# EAGLE design Trackball-9500 (EAGLE 5.11)
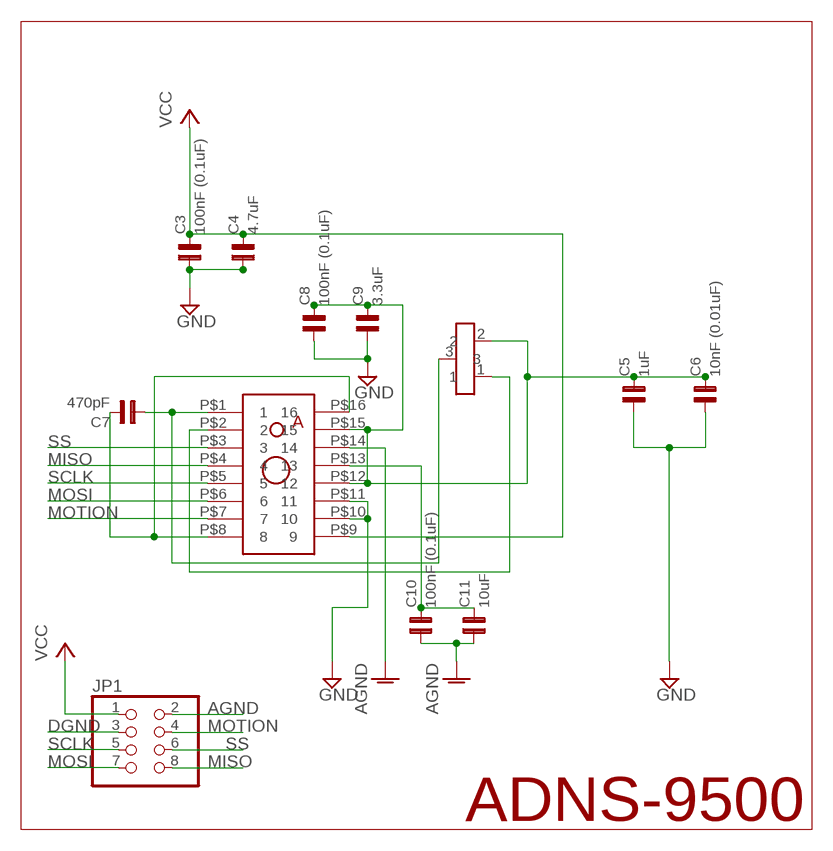
[diagram p0: schematic, sheet 1]

## Parts
C3  100nF (0.1uF)  C0603  [0603]
C4  4.7uF  C0805  [0805]
C5  1uF  C0805  [0805]
C6  10nF (0.01uF)  C0603  [0603]
C7  470pF  C0603  [0603]
C8  100nF (0.1uF)  C0603  [0603]
C9  3.3uF  C0805  [0805]
C10  100nF (0.1uF)  C0603  [0603]
C11  10uF  C0805  [0805]
JP1  PINHD-2X4  [2X04]
Q1  TRANSISTOR_SC-75  [SC-75_TRANSISTOR]
U$1  AVAGO_ADNS-9500  [AVAGO_ADNS-9500]

## Nets
AGND: C3.1 C4.1 C5.1 C6.1 C8.1 C9.1 C10.1 C11.1 JP1.2 U$1.P$10 U$1.P$11 ; supply symbol labelled GND
DGND: JP1.3 U$1.P$14 ; supply symbol labelled AGND
MISO: JP1.8 U$1.P$4
MOSI: JP1.7 U$1.P$6
MOTION: JP1.4 U$1.P$7
N$1: Q1.1 U$1.P$2
N$2: C7.1 Q1.3 U$1.P$1
N$3: C5.2 C6.2 C8.2 C9.2 Q1.2 U$1.P$12 U$1.P$15
N$4: C7.2 U$1.P$8 U$1.P$16
N$7: C10.2 C11.2 U$1.P$13
SCLK: JP1.5 U$1.P$5
SS: JP1.6 U$1.P$3
VCC: C3.2 C4.2 JP1.1 U$1.P$9

## Notes on the sheet
- ADNS-9500

## Library data of the parts
C3 C6-C8 C10 = capsmd:C0603
C4 C5 C9 C11 = capsmd:C0805
JP1 = pinhead:PINHD-2X4: PIN HEADER
Q1 = JKCustom:TRANSISTOR_SC-75: SC-75 Package
U$1 = JKCustom:AVAGO_ADNS-9500

## Net classes
0 default: width 0.254 mm

## Board
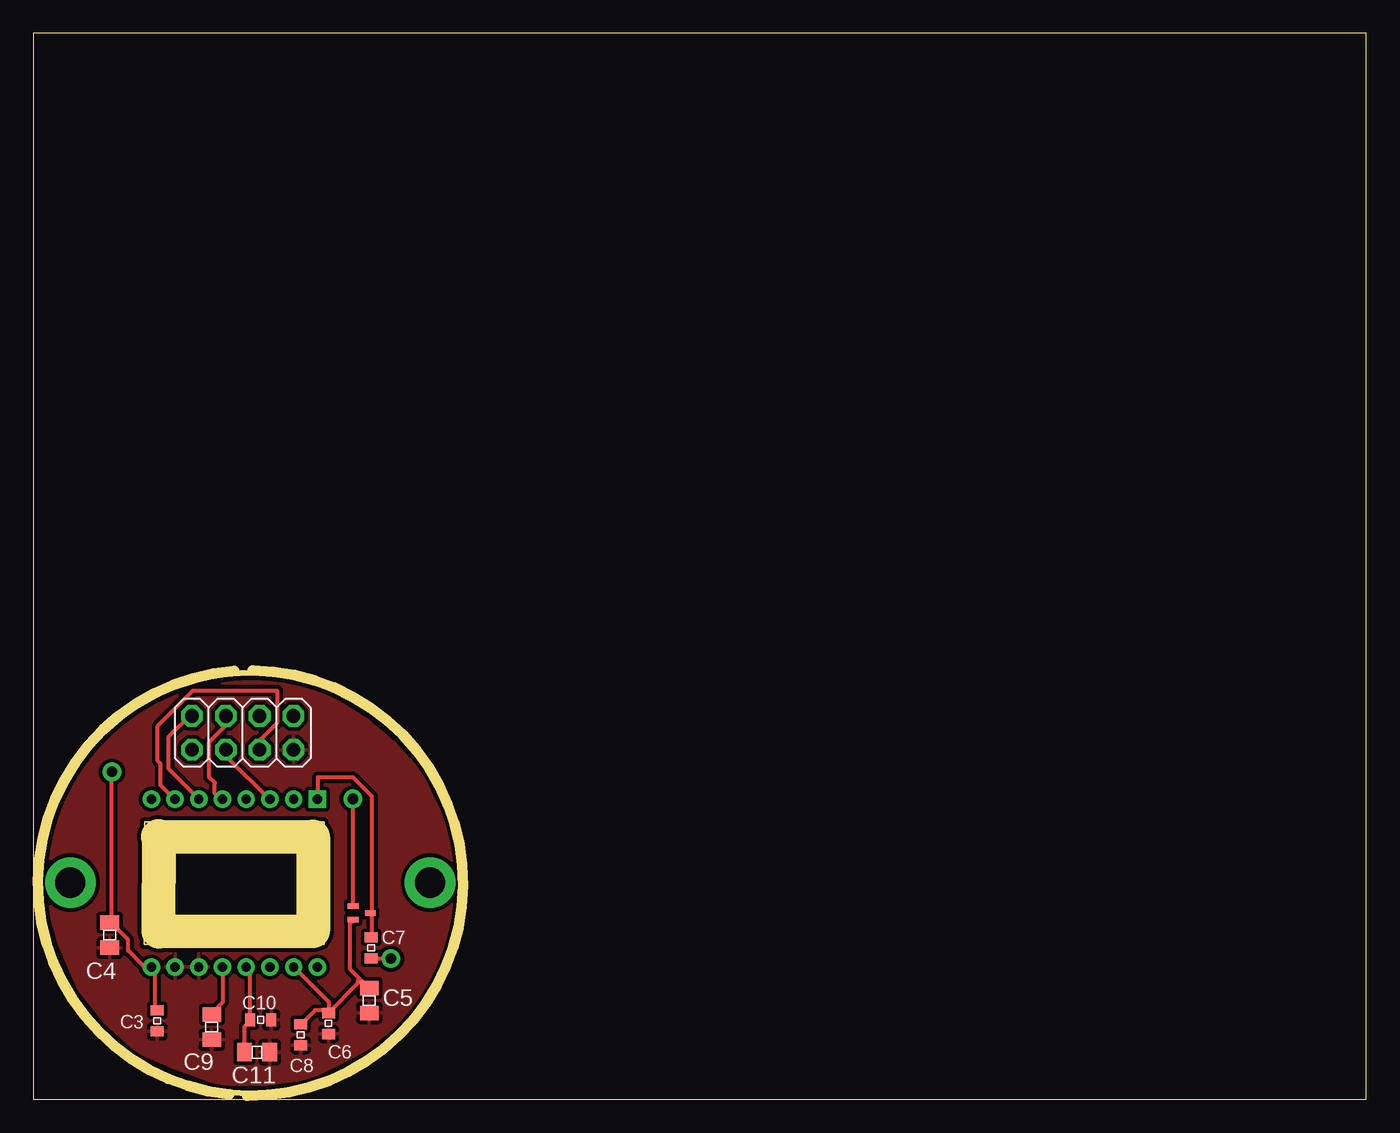
[diagram p1: board, top side]
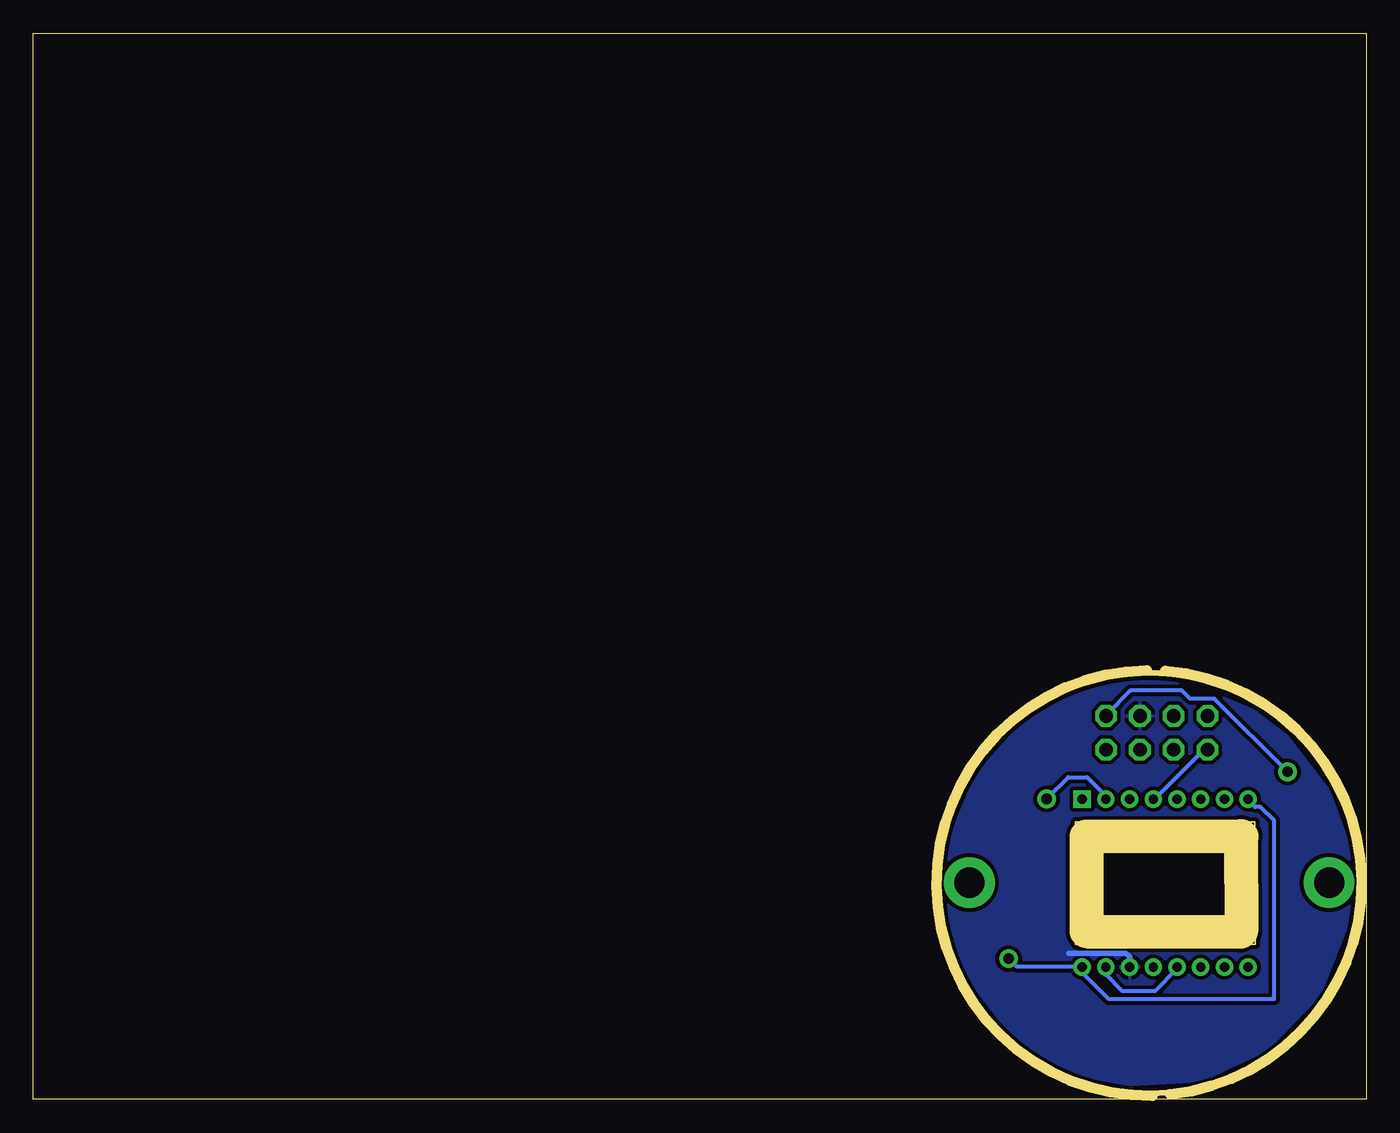
[diagram p2: board, bottom side, seen from below]

Size 100 x 80 mm. Coordinates in mm from the lower left corner, seen from the top.
Outline: 9.4,19.76 9.38,12.62
Outline: 9.35,19.74 20.98,19.71 20.98,12.62 9.43,12.6
Outline: 0,0 100,0 100,80 0,80 0,0
Outline: circle at 16.29,16.23 radius 15.76
Copper layers (1*16): Top 0.035mm / dielectric 1.5mm / Bottom 0.035mm
Design rules "default *": minimum track width 12mil, minimum drill 0.7938mm, track to track 10mil, track to pad 10mil, pad to pad 10mil, via to via 10mil, smd to smd 10mil, copper to edge 10mil, drill to drill 6mil, minimum pad ring 12mil, minimum via ring 12mil, stop-mask expansion 12mil, vias tented up to drill 0mil, thermal gap 12mil
Milling: 2 lines

### Footprints (pad centres in the part's own frame; a part is rotated, then mirrored left to right if it is on the bottom)
0603 = smd 0.762 x 0.965: 1 -0.787,0; 2 0.787,0
0805 = smd 1.092 x 1.397: 1 -0.94,0; 2 0.94,0
2X04 = drill 1.016 octagon: 1 -3.81,-1.27; 2 -3.81,1.27; 3 -1.27,-1.27; 4 -1.27,1.27; 5 1.27,-1.27; 6 1.27,1.27; 7 3.81,-1.27; 8 3.81,1.27
SC-75_TRANSISTOR = smd 0.406 x 0.813: 1 0.2,0.4; 2 1.2,0.4; 3 0.7,1.7
AVAGO_ADNS-9500 = drill 0.7 pad 1.3 square: P$1 0,0 | drill 0.7 pad 1.3 round: P$2 -1.78,0; P$3 -3.56,0; P$4 -5.34,0; P$5 -7.12,0; P$6 -8.9,0; P$7 -10.68,0; P$8 -12.46,0; P$9 -12.46,-12.6; P$10 -10.68,-12.6; P$11 -8.9,-12.6; P$12 -7.12,-12.6; P$13 -5.34,-12.6; P$14 -3.56,-12.6; P$15 -1.78,-12.6; P$16 0,-12.6

### Placement (x,y rotation side)
C3  9.3,5.89 90 top
C4  5.73,12.33 90 top
C5  25.2,7.43 90 top
C6  22.15,5.7 90 top
C7  25.35,11.39 270 top
C8  20.06,4.87 90 top
C9  13.39,5.42 90 top
C10  17.06,5.97 180 top
C11  16.79,3.55 180 top
JP1  15.71,27.51 180 top
Q1  23.59,14.7 270 top
U$1  21.31,22.54 0 top

### Tracks (layer width: path | path; a pad name or v marks a point on that pad's centre or on a via)
AGND
  pour Top (isolate 0.279): 15.88,31.6 arc6 13.79,31.34 11.79,30.94 10.39,30.25 8.36,29.29 6.78,28.19 4.68,26.09 3,23.78 2.06,21.82 1.35,19.63 1.09,17.83 1.09,14.63 1.98,11.61 3.46,8.23 5.39,5.79 7.88,3.53 10.62,2.36 14.02,1.14 17.4,1.14 20.6,1.55 22.43,2.44 25.05,3.81 26.88,5.36 28.86,7.49 30.05,9.45 31.02,12.12 31.55,14.96 31.37,18.82 30.48,21.57 28.98,24.66 27.08,26.77 25.12,28.4 22.84,29.85 20.4,31.01 18.11,31.4 16.36,31.6
DGND
  Bottom 0.406: U$1.P$14 17.75,10.69 18.04,10.97 22.3,10.97
  pour Bottom (isolate 0.279): 15.24,31.55 arc20 12.37,30.86 8.44,29.16 5.97,27.28 2.85,23.24 1.25,18.85 0.97,16.13 1.55,12.78 3.53,7.82 7.47,3.73 12.45,1.42 17.66,1.12 22,1.91 26.65,4.93 30.1,9.4 31.52,14.17 31.37,19.13 29.29,24.28 26.06,27.94 21.74,30.51 18.44,31.4
MISO
  Bottom 0.305: U$1.P$4 15.85,22.56 12.19,26.21 11.99,26.21 JP1.8
MOSI
  Top 0.305: U$1.P$6 12.4,22.56 10.16,24.79 10.16,27.23 11.79,28.85 JP1.7
MOTION
  Top 0.305: U$1.P$7 10.57,22.56 9.55,23.57 9.55,25.2 9.35,25.4 9.35,28.04 11.99,30.68 18.29,30.68 18.29,28.25 17.07,27.03 17.07,26.42 JP1.4
N$1  (via drill 0.79)
  Top 0.305: v23.98,22.56 23.98,14.63 Q1.1
  Bottom 0.305: v23.98,22.56 22.35,24.18 20.93,24.18 19.71,22.96 19.71,22.56 U$1.P$2
N$2
  Top 0.305: C7.1 25.4,12.19 25.4,13.82 Q1.3 25.4,14.02 25.4,22.76 23.98,24.18 21.34,24.18 21.34,22.56 U$1.P$1
N$3
  Top 0.305: C9.2 13.41,6.5 14.23,7.32 14.23,9.75 U$1.P$12 | C8.2 20.12,5.69 21.14,6.71 21.95,6.71 21.95,6.5 C6.2 | 24.49,9.04 25.2,8.33 C5.2 | 24.49,9.04 23.78,9.75 23.78,13.21 23.98,13.41 Q1.2 | C6.2 22.15,6.5 24.39,8.74 24.39,8.94 24.49,9.04 | U$1.P$15 19.71,9.75 22.15,7.32 22.15,6.71 C6.2
  Bottom 0.305: U$1.P$12 14.23,9.75 15.85,8.13 18.29,8.13 19.51,9.35 19.51,9.75 U$1.P$15
N$4  (via drill 0.79)
  Top 0.305: v26.82,10.57 25.4,10.57 C7.2
  Bottom 0.305: v26.82,10.57 26.22,9.96 21.74,9.96 | 21.74,9.96 21.34,9.96 U$1.P$16 21.74,9.96 | 21.74,9.96 19.31,7.52 6.91,7.52 6.91,20.93 7.93,21.95 8.33,21.95 8.74,22.35 U$1.P$8
N$5  (via drill 2.26 pad 3.81)
  other vias: 29.77,16.27
N$6  (via drill 2.26 pad 3.81)
  other vias: 2.78,16.27
N$7
  Top 0.305: C11.2 15.85,3.66 15.85,5.49 16.26,5.89 C10.2 16.26,6.1 16.26,9.55 16.06,9.75 U$1.P$13
SCLK
  Top 0.305: U$1.P$5 14.02,22.56 13.62,22.96 13.62,23.77 13.21,24.18 13.21,26.82 14.63,28.25 14.63,28.65 JP1.5
SS
  Top 0.305: U$1.P$3 17.68,22.56 14.63,25.6 14.63,26.21 JP1.6
VCC  (via drill 0.79)
  Top 0.305: C3.2 9.15,6.71 9.15,9.55 8.94,9.75 U$1.P$9 8.74,9.96 8.33,9.96 7.11,11.18 7.11,11.99 5.9,13.21 C4.2 5.9,13.41 v5.9,24.59
  Bottom 0.305: v5.9,24.59 11.38,30.07 13.21,30.07 13.82,30.68 17.68,30.68 19.51,28.85 JP1.1